# EAGLE schematic rc (EAGLE 7.3.0)
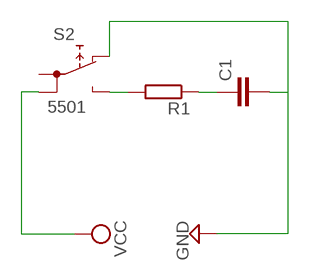
[diagram p0: schematic, sheet 1]

## Parts
C1  C5/2.5  [C5B2.5]
R1  R-EU_0204/5  [0204/5]
S2  5501  [5501]

## Nets
GND: C1.2 S2.NC
N$1: R1.2 S2.NO
N$2: C1.1 R1.1
VCC: S2.1B
Unconnected: S2.1A

## Library data of the parts
C1 = capacitor-wima:C: CAPACITOR naming: grid - package width
R1 = resistor:R-EU_: RESISTOR, European symbol
S2 = switch:55?: PUSHBUTTON SERIES 5500 SWITCHES Source: www.e-switch.com .. 5500.pdf